# EAGLE design out-gain (EAGLE 6.4)
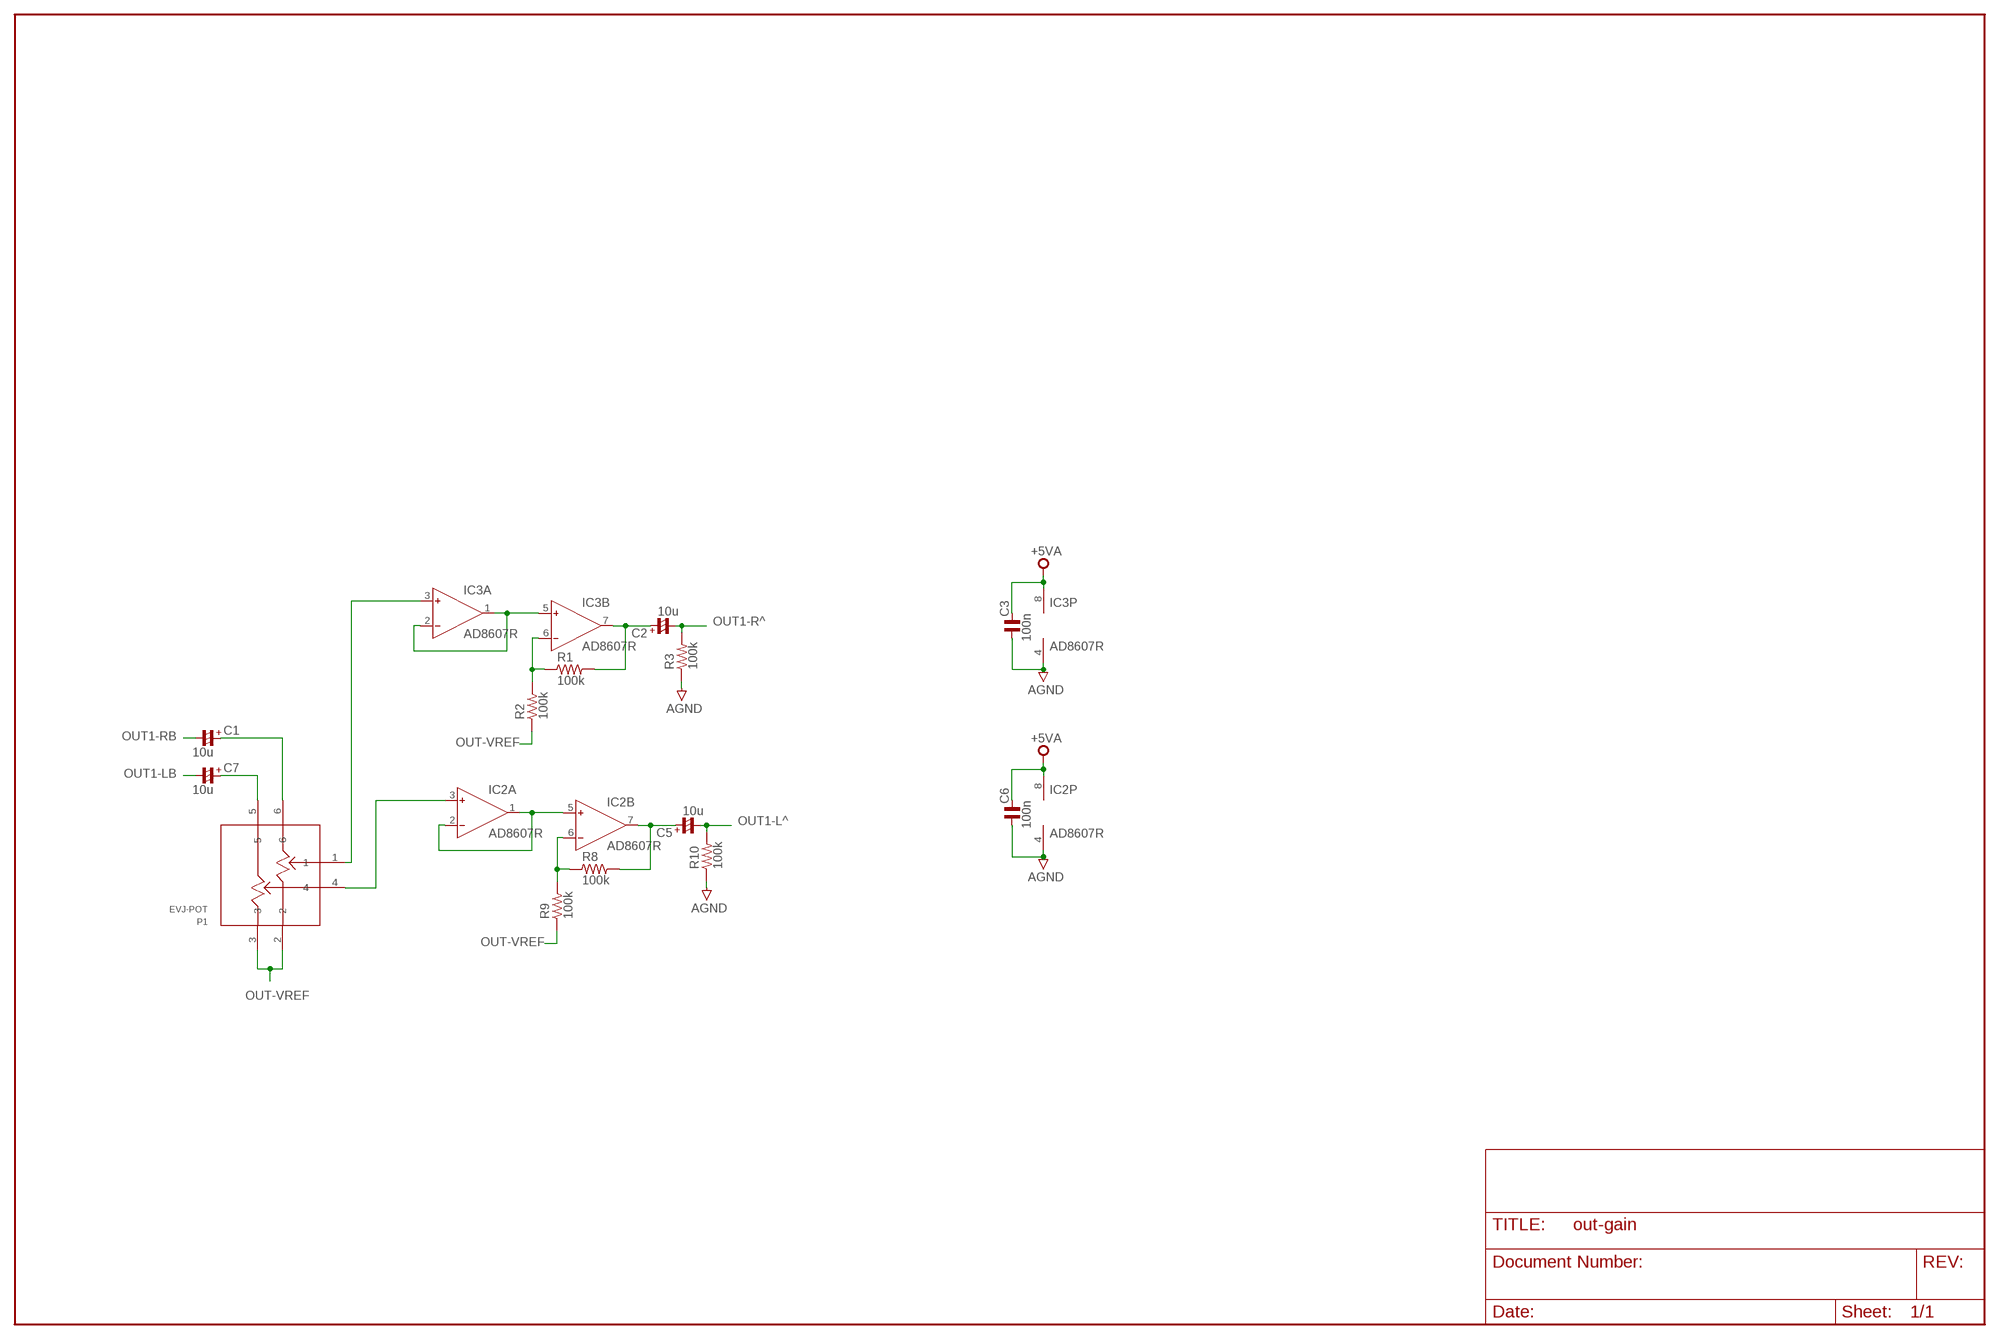
[diagram p0: schematic, sheet 1]

## Parts
C1  10u  CP_1206/T  [C1206/T]
C2  10u  CP_1206/T  [C1206/T]
C3  100n  C_0603  [C0603]
C5  10u  CP_1206/T  [C1206/T]
C6  100n  C_0603  [C0603]
C7  10u  CP_1206/T  [C1206/T]
IC2  AD8607R  [SO8]
IC3  AD8607R  [SO8]
P1  EVJ-POT  [EVJ-POT]
R1  100k  R_0603  [R0603]
R2  100k  R_0603  [R0603]
R3  100k  R_0603  [R0603]
R8  100k  R_0603  [R0603]
R9  100k  R_0603  [R0603]
R10  100k  R_0603  [R0603]

## Nets
+5VA: C3.2 C6.2 IC2.8(P:V+) IC3.8(P:V+)
AGND: C3.1 C6.1 IC2.4(P:V-) IC3.4(P:V-) R3.1 R10.1
N$1: IC3.3(A:IN+) P1.1
N$2: IC3.1(A:OUT) IC3.2(A:IN-) IC3.5(B:IN+)
N$3: C2.+ IC3.7(B:OUT) R1.2
N$4: IC3.6(B:IN-) R1.1 R2.2
N$8: C1.+ P1.6
N$10: IC2.3(A:IN+) P1.4
N$11: C7.+ P1.5
N$33: IC2.1(A:OUT) IC2.2(A:IN-) IC2.5(B:IN+)
N$41: C5.+ IC2.7(B:OUT) R8.2
N$47: IC2.6(B:IN-) R8.1 R9.2
OUT1-L^: C5.- R10.2
OUT1-LB: C7.-
OUT1-R^: C2.- R3.2
OUT1-RB: C1.-
OUT-VREF: P1.2 P1.3 R2.1 R9.1

## Library data of the parts
C1 C2 C5 C7 = rc-master-smd:CP_: POLARIZED CAP
C3 C6 = rc-master-smd:C_: NON-POLARIZED CAP
IC2 IC3 = analog-devices:AD8607: Precision Micropower, Low Noise CMOS, Rail-to-Rail Input/Output Operational Amplifiers Source: http://www.analog.com/static/imported-files/data_sheets/AD8603_8607_8609.pdf; MPN: AD8607ARMZ-R2; OC_FARNELL: 1651293; OC_NEWARK: 19M8927
P1 = monome-inc:EVJ-POT: audio pot
R1-R3 R8-R10 = rc-master-smd:R_: RESISTOR

## Board
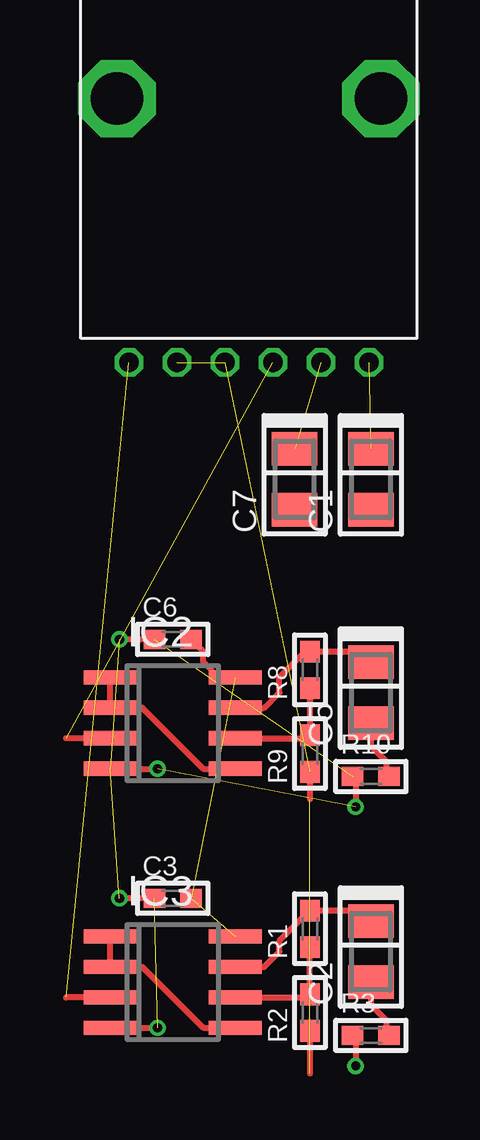
[diagram p1: board, top side]
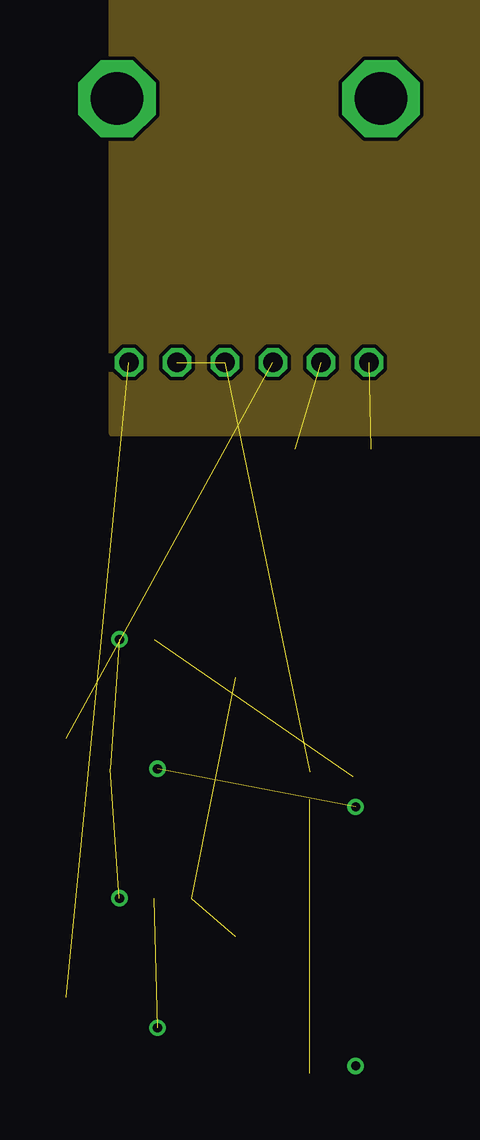
[diagram p2: board, inner layer Route2]
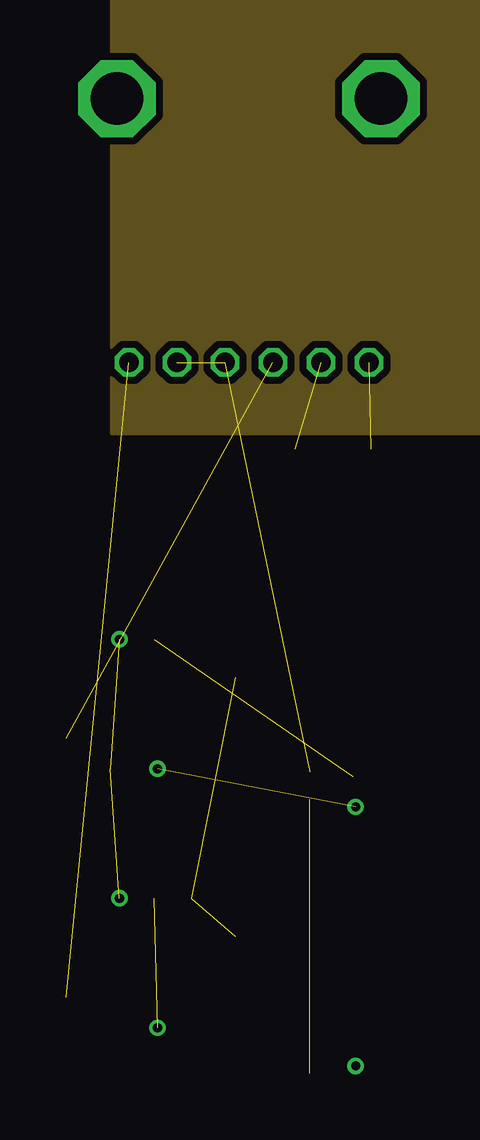
[diagram p3: board, inner layer Route3]

No outline drawn. Coordinates in mm, seen from the top.
Copper layers (1*2+3*16): Top 0.035mm / dielectric 1.5mm / Route2 0.035mm / dielectric 0.15mm / Route3 0.035mm / dielectric 0.2mm / Bottom 0.035mm
Design rules "default *": minimum track width 6mil, minimum drill 15mil, track to track 6mil, track to pad 6mil, pad to pad 6mil, via to via 6mil, smd to smd 6mil, copper to edge 10mil, drill to drill 8mil, minimum pad ring 6mil, minimum via ring 6mil, stop-mask expansion 4mil, vias tented up to drill 0mil, thermal gap 10mil

### Footprints (pad centres in the part's own frame; a part is rotated, then mirrored left to right if it is on the bottom)
C1206/T = smd 1.4 x 1.9: + 1.27,0; - -1.27,0
C0603 = smd 0.9 x 0.8: 1 -0.762,0; 2 0.762,0
SO8 = smd 0.6 x 2.2: 1 -1.905,-2.6; 2 -0.635,-2.6; 3 0.635,-2.6; 4 1.905,-2.6; 5 1.905,2.6; 6 0.635,2.6; 7 -0.635,2.6; 8 -1.905,2.6
EVJ-POT = drill 0.8 octagon: 1 -5,-11; 2 -3,-11; 3 -1,-11; 4 1,-11; 5 3,-11; 6 5,-11 | drill 2.2 octagon: M1 -5.5,0; M2 5.5,0
R0603 = smd 0.9 x 0.8: 1 -0.762,0; 2 0.762,0

### Placement (x,y rotation side)
C1  10.79,-149.22 90 top
C2  10.79,-168.91 90 top
C3  2.54,-166.69 0 top
C5  10.79,-158.12 90 top
C6  2.54,-155.89 0 top
C7  7.62,-149.22 90 top
IC2  2.54,-159.38 270 top
IC3  2.54,-170.18 270 top
P1  5.71,-133.35 0 top
R1  8.26,-167.96 90 top
R2  8.26,-171.45 90 top
R3  10.79,-172.4 0 top
R8  8.26,-157.16 90 top
R9  8.26,-160.66 90 top
R10  10.79,-161.61 0 top

### Tracks (layer width: path | path; a pad name or v marks a point on that pad's centre or on a via)
+3V3
  pour Route2 (isolate 0.305): 134.62,74.93 134.62,77.47 133.35,78.74 113.03,78.74 111.76,77.47 114.3,74.93 114.3,11.43 104.14,1.27 104.14,0 172.72,0 172.72,111.76 156.21,111.76 156.21,72.39 154.94,71.12 147.32,71.12 147.32,43.18 144.78,40.64 123.19,40.64 119.38,44.45 119.38,66.04 123.19,69.85 129.54,69.85
  pour Route2 (isolate 0.305): 134.62,-72.39 134.62,-69.85 133.35,-68.58 113.03,-68.58 111.76,-69.85 114.3,-72.39 114.3,-135.89 104.14,-146.05 104.14,-147.32 172.72,-147.32 172.72,-35.56 156.21,-35.56 156.21,-74.93 154.94,-76.2 147.32,-76.2 147.32,-104.14 144.78,-106.68 123.19,-106.68 119.38,-102.87 119.38,-81.28 123.19,-77.47 129.54,-77.47
+3V3A
  pour Route2: 0,111.76 97.79,111.76 97.79,86.36 88.9,77.47 86.36,77.47 63.5,54.61 63.5,32.38 69.85,26.04 69.85,0 0,0
  pour Route2: 0,-35.56 97.79,-35.56 97.79,-60.96 88.9,-69.85 86.36,-69.85 63.5,-92.71 63.5,-114.94 69.85,-121.28 69.85,-147.32 0,-147.32
+3V3C
  pour Route2: 109.22,76.2 110.49,76.2 113.03,73.66 113.03,12.7 102.87,2.54 102.87,0 71.12,0 71.12,26.67 64.77,33.02 64.77,53.34 74.93,63.5 74.93,30.48 76.2,29.21 106.68,29.21 107.95,30.48 107.95,60.96 106.68,62.23 76.2,62.23 76.2,64.77 82.55,71.12 104.14,71.12
  pour Route2: 109.22,-71.12 110.49,-71.12 113.03,-73.66 113.03,-134.62 102.87,-144.78 102.87,-147.32 71.12,-147.32 71.12,-120.65 64.77,-114.3 64.77,-93.98 74.93,-83.82 74.93,-116.84 76.2,-118.11 106.68,-118.11 107.95,-116.84 107.95,-86.36 106.68,-85.09 76.2,-85.09 76.2,-82.55 82.55,-76.2 104.14,-76.2
+5V
  pour Route2 (isolate 0.305): 153.67,72.39 143.51,72.39 135.89,80.01 110.49,80.01 102.87,72.39 83.82,72.39 87.63,76.2 90.17,76.2 99.06,85.09 99.06,111.76 154.94,111.76 154.94,73.66
  pour Route2 (isolate 0.305): 153.67,-74.93 143.51,-74.93 135.89,-67.31 110.49,-67.31 102.87,-74.93 83.82,-74.93 87.63,-71.12 90.17,-71.12 99.06,-62.23 99.06,-35.56 154.94,-35.56 154.94,-73.66
+5VA  (2 unrouted)
  Top 0.254: IC2.8 4.45,-157.48 3.81,-156.84 3.81,-156.4 C6.2
AGND  (via drill 0.38)  (5 unrouted)
  Top 0.254: IC2.4 v1.91,-161.29 | C6.1 v0.32,-155.89 | R10.1 10.16,-161.61 v10.16,-162.88 | R3.1 10.16,-172.72 v10.16,-173.67 | IC3.4 v1.91,-172.09 | C3.1 v0.32,-166.69
  pour Route3 (isolate 0.305): 97.79,111.76 97.79,86.36 88.9,77.47 86.36,77.47 63.5,54.61 63.5,32.38 69.85,26.04 69.85,23.5 65.41,19.05 61.59,19.05 59.05,21.59 0,21.59 0,111.76
  pour Route3 (isolate 0.305): 97.79,-35.56 97.79,-60.96 88.9,-69.85 86.36,-69.85 63.5,-92.71 63.5,-114.94 69.85,-121.28 69.85,-123.83 65.41,-128.27 61.59,-128.27 59.05,-125.73 0,-125.73 0,-35.56
GND
  pour Route3 (isolate 0.305): 0,0 172.72,0 172.72,111.76 99.06,111.76 99.06,85.09 90.17,76.2 87.63,76.2 64.77,53.34 64.77,33.02 71.12,26.67 71.12,22.86 66.04,17.78 60.96,17.78 58.42,20.32 0,20.32
  pour Route3 (isolate 0.305): 0,-147.32 172.72,-147.32 172.72,-35.56 99.06,-35.56 99.06,-62.23 90.17,-71.12 87.63,-71.12 64.77,-93.98 64.77,-114.3 71.12,-120.65 71.12,-124.46 66.04,-129.54 60.96,-129.54 58.42,-127 0,-127
N$1  (1 unrouted)
  Top 0.254: 0,-170.81 IC3.3 -1.91,-170.81
N$2
  Top 0.254: IC3.5 3.81,-172.09 1.27,-169.54 IC3.2 IC3.1
N$3
  Top 0.254: IC3.7 6.35,-169.54 6.99,-168.91 6.99,-168.47 R1.2 10.35,-167.2 C2.+
N$4
  Top 0.254: IC3.6 8.13,-170.81 R2.2 R1.1
N$8  (1 unrouted)
N$10  (1 unrouted)
  Top 0.254: IC2.3 -1.91,-160.02
N$11  (1 unrouted)
N$33
  Top 0.254: IC2.5 3.81,-161.29 1.27,-158.75 IC2.2 IC2.1
N$41
  Top 0.254: IC2.7 6.35,-158.75 6.99,-158.12 6.99,-157.48 7.94,-156.53 8.45,-156.53 R8.2 10.35,-156.4 C5.+ 10.67,-156.72
N$47
  Top 0.254: IC2.6 8.38,-160.02 R9.2 R8.1
OUT1-L^
  Top 0.254: C5.- 10.79,-160.34 11.43,-160.97 11.43,-161.48 R10.2
OUT1-R^
  Top 0.254: C2.- 10.79,-171.13 11.43,-171.77 11.43,-172.59 R3.2
OUT-VREF  (3 unrouted)
  Top 0.254: R9.1 8.26,-162.56 | R2.1 8.26,-173.99
VDDEXT
  pour Route2: 80.01,59.69 77.47,57.15 77.47,33.02 78.74,31.75 104.14,31.75 105.41,33.02 105.41,58.42 104.14,59.69 91.44,59.69 91.44,60.96 105.41,60.96 106.68,59.69 106.68,31.75 105.41,30.48 77.47,30.48 76.2,31.75 76.2,60.96 88.9,60.96 88.9,59.69
  pour Route2: 80.01,-87.63 77.47,-90.17 77.47,-114.3 78.74,-115.57 104.14,-115.57 105.41,-114.3 105.41,-88.9 104.14,-87.63 91.44,-87.63 91.44,-86.36 105.41,-86.36 106.68,-87.63 106.68,-115.57 105.41,-116.84 77.47,-116.84 76.2,-115.57 76.2,-86.36 88.9,-86.36 88.9,-87.63
VDDINT
  pour Route2 (isolate 0.305): 78.74,34.29 80.01,33.02 102.87,33.02 104.14,34.29 104.14,57.15 102.87,58.42 80.64,58.42 78.74,56.52
  pour Route2 (isolate 0.305): 78.74,-113.03 80.01,-114.3 102.87,-114.3 104.14,-113.03 104.14,-90.17 102.87,-88.9 80.64,-88.9 78.74,-90.81
VDDIO
  pour Route2 (isolate 0.305): 143.51,41.91 146.05,44.45 146.05,71.12 142.24,71.12 138.43,74.93 135.89,74.93 129.54,68.58 124.46,68.58 120.65,64.77 120.65,45.72 124.46,41.91
  pour Route2 (isolate 0.305): 143.51,-105.41 146.05,-102.87 146.05,-76.2 142.24,-76.2 138.43,-72.39 135.89,-72.39 129.54,-78.74 124.46,-78.74 120.65,-82.55 120.65,-101.6 124.46,-105.41